# EAGLE design platform_smd2 (EAGLE 6.5.0)
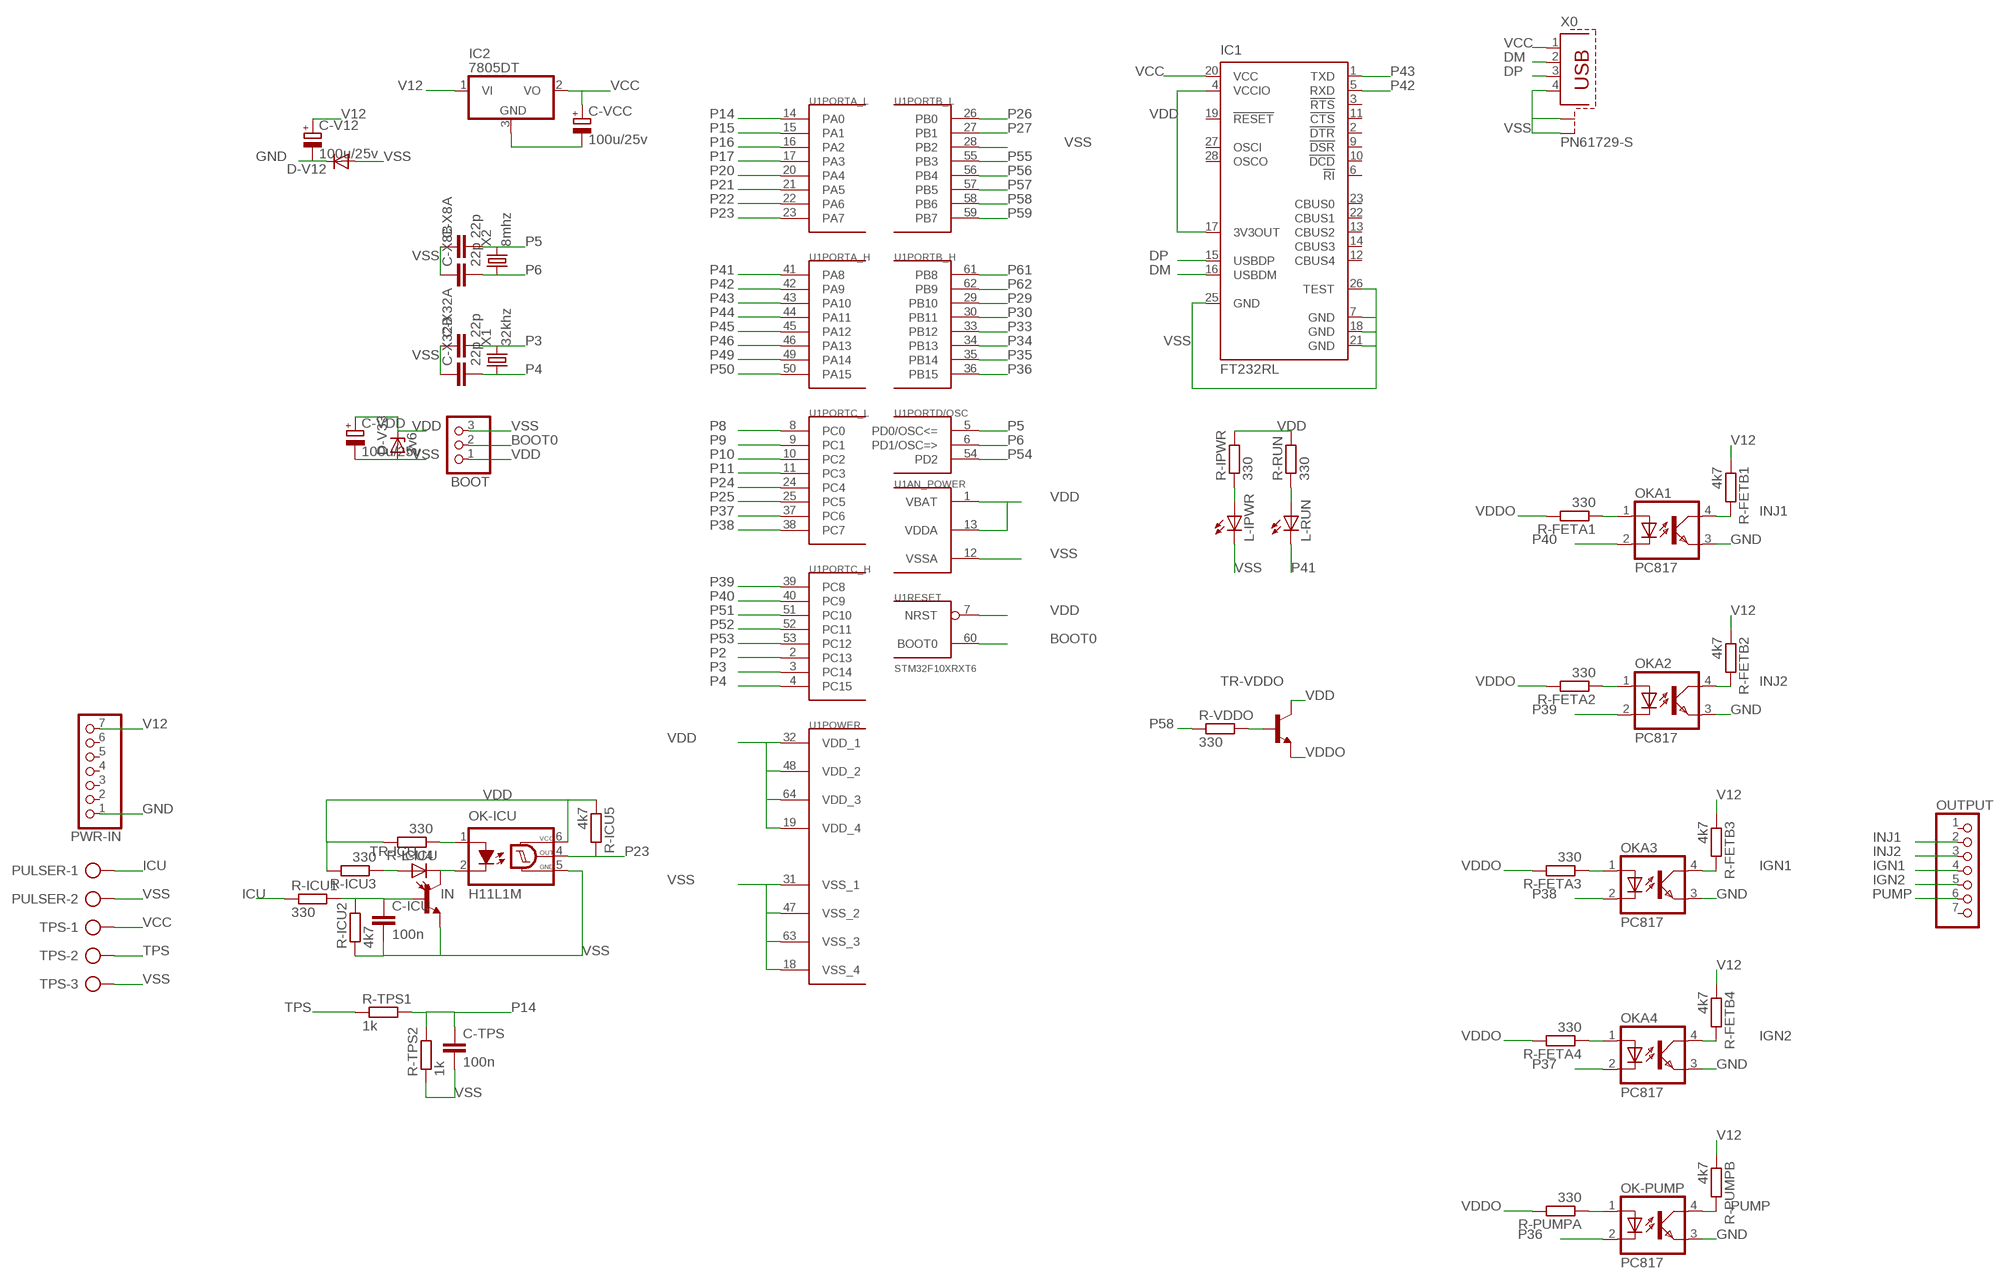
[diagram p0: schematic, sheet 1]

## Parts
BOOT  PINHD-1X3  [1X03]
C-ICU  100n  C-EUC1206  [C1206]
C-TPS  100n  C-EUC1206  [C1206]
C-V12  100u/25v  CPOL-EUD  [PANASONIC_D]
C-VCC  100u/25v  CPOL-EUD  [PANASONIC_D]
C-VDD  100u/25v  CPOL-EUD  [PANASONIC_D]
C-X8A  22p  C-EUC1206  [C1206]
C-X8B  22p  C-EUC1206  [C1206]
C-X32A  22p  C-EUC1206  [C1206]
C-X32B  22p  C-EUC1206  [C1206]
D-V12  DIODE-SMB  [SMB]
D-V33  3v6  ZENER-DIODESMB  [SMB]
IC1  FT232RL  [SSOP28]
IC2  7805DT  [TO252]
L-ICU  LEDSML0805  [SML0805]
L-IPWR  LEDSMT1206  [1206]
L-RUN  LEDSMT1206  [1206]
OK-ICU  H11L1M  [DIL06]
OK-PUMP  PC817  [DIL04]
OKA1  PC817  [DIL04]
OKA2  PC817  [DIL04]
OKA3  PC817  [DIL04]
OKA4  PC817  [DIL04]
OUTPUT  PINHD-1X7  [1X07]
PULSER  AK300/2  [AK300/2]
PWR-IN  PINHD-1X7  [1X07]
R-FETA1  330  R-EU_R1206  [R1206]
R-FETA2  330  R-EU_R1206  [R1206]
R-FETA3  330  R-EU_R1206  [R1206]
R-FETA4  330  R-EU_R1206  [R1206]
R-FETB1  4k7  R-EU_R1206  [R1206]
R-FETB2  4k7  R-EU_R1206  [R1206]
R-FETB3  4k7  R-EU_R1206  [R1206]
R-FETB4  4k7  R-EU_R1206  [R1206]
R-ICU1  330  R-EU_R1206  [R1206]
R-ICU2  4k7  R-EU_R1206  [R1206]
R-ICU3  330  R-EU_R1206  [R1206]
R-ICU4  330  R-EU_R1206  [R1206]
R-ICU5  4k7  R-EU_R1206  [R1206]
R-IPWR  330  R-EU_R1206  [R1206]
R-PUMPA  330  R-EU_R1206  [R1206]
R-PUMPB  4k7  R-EU_R1206  [R1206]
R-RUN  330  R-EU_R1206  [R1206]
R-TPS1  1k  R-EU_R1206  [R1206]
R-TPS2  1k  R-EU_R1206  [R1206]
R-VDDO  330  R-EU_R0805  [R0805]
TPS  AK300/3  [AK300/3]
TR-ICU  MMBT3904LT1-NPN-SOT23-BEC  [SOT23-BEC]
TR-VDDO  MMBT3904LT1-NPN-SOT23-BEC  [SOT23-BEC]
U1  STM32F10XRXT6  [TQFP64]
X0  PN61729-S  [PN61729-S]
X1  32khz  CRYSTALTC26V  [TC26V]
X2  8mhz  CRYSTALHC49U-V  [HC49U-V]

## Nets
BOOT0: BOOT.2 U1.60(RESET:BOOT0)
DM: IC1.16(USBDM) X0.2
DP: IC1.15(USBDP) X0.3
GND: C-V12.- D-V12.C OK-PUMP.3(EMIT) OKA1.3(EMIT) OKA2.3(EMIT) OKA3.3(EMIT) OKA4.3(EMIT) PWR-IN.1
ICU: PULSER.1 R-ICU1.1
IGN1: OKA3.4(COL) OUTPUT.4 R-FETB3.2
IGN2: OKA4.4(COL) OUTPUT.5 R-FETB4.2
IN: L-ICU.C OK-ICU.2(C) TR-ICU.C
INJ1: OKA1.4(COL) OUTPUT.2 R-FETB1.2
INJ2: OKA2.4(COL) OUTPUT.3 R-FETB2.2
N$3: C-ICU.1 R-ICU1.2 R-ICU2.2 TR-ICU.B
N$5: OK-ICU.1(A) R-ICU4.1
N$6: L-ICU.A R-ICU3.1
N$7: L-IPWR.A R-IPWR.1
N$8: L-RUN.A R-RUN.1
N$9: OK-PUMP.1(A) R-PUMPA.1
N$12: OKA2.1(A) R-FETA2.1
N$13: OKA1.1(A) R-FETA1.1
N$15: OKA3.1(A) R-FETA3.1
N$17: OKA4.1(A) R-FETA4.1
N$19: R-VDDO.2 TR-VDDO.B
P2: U1.2(PORTC_H:PC13)
P3: C-X32A.2 U1.3(PORTC_H:PC14) X1.2
P4: C-X32B.2 U1.4(PORTC_H:PC15) X1.1
P5: C-X8A.2 U1.5(PORTD/OSC:PD0/OSC<=) X2.2
P6: C-X8B.2 U1.6(PORTD/OSC:PD1/OSC=>) X2.1
P8: U1.8(PORTC_L:PC0)
P9: U1.9(PORTC_L:PC1)
P10: U1.10(PORTC_L:PC2)
P11: U1.11(PORTC_L:PC3)
P14: C-TPS.1 R-TPS1.2 R-TPS2.2 U1.14(PORTA_L:PA0)
P15: U1.15(PORTA_L:PA1)
P16: U1.16(PORTA_L:PA2)
P17: U1.17(PORTA_L:PA3)
P20: U1.20(PORTA_L:PA4)
P21: U1.21(PORTA_L:PA5)
P22: U1.22(PORTA_L:PA6)
P23: OK-ICU.4(OUT) R-ICU5.2 U1.23(PORTA_L:PA7)
P24: U1.24(PORTC_L:PC4)
P25: U1.25(PORTC_L:PC5)
P26: U1.26(PORTB_L:PB0)
P27: U1.27(PORTB_L:PB1)
P29: U1.29(PORTB_H:PB10)
P30: U1.30(PORTB_H:PB11)
P33: U1.33(PORTB_H:PB12)
P34: U1.34(PORTB_H:PB13)
P35: U1.35(PORTB_H:PB14)
P36: OK-PUMP.2(C) U1.36(PORTB_H:PB15)
P37: OKA4.2(C) U1.37(PORTC_L:PC6)
P38: OKA3.2(C) U1.38(PORTC_L:PC7)
P39: OKA2.2(C) U1.39(PORTC_H:PC8)
P40: OKA1.2(C) U1.40(PORTC_H:PC9)
P41: L-RUN.C U1.41(PORTA_H:PA8)
P42: IC1.5(RXD) U1.42(PORTA_H:PA9)
P43: IC1.1(TXD) U1.43(PORTA_H:PA10)
P44: U1.44(PORTA_H:PA11)
P45: U1.45(PORTA_H:PA12)
P46: U1.46(PORTA_H:PA13)
P49: U1.49(PORTA_H:PA14)
P50: U1.50(PORTA_H:PA15)
P51: U1.51(PORTC_H:PC10)
P52: U1.52(PORTC_H:PC11)
P53: U1.53(PORTC_H:PC12)
P54: U1.54(PORTD/OSC:PD2)
P55: U1.55(PORTB_L:PB3)
P56: U1.56(PORTB_L:PB4)
P57: U1.57(PORTB_L:PB5)
P58: R-VDDO.1 U1.58(PORTB_L:PB6)
P59: U1.59(PORTB_L:PB7)
P61: U1.61(PORTB_H:PB8)
P62: U1.62(PORTB_H:PB9)
PUMP: OK-PUMP.4(COL) OUTPUT.6 R-PUMPB.2
TPS: R-TPS1.1 TPS.2
V12: C-V12.+ IC2.1(VI) PWR-IN.7 R-FETB1.1 R-FETB2.1 R-FETB3.1 R-FETB4.1 R-PUMPB.1
VCC: C-VCC.+ IC1.20(VCC) IC2.2(VO) TPS.1 X0.1
VDD: BOOT.1 C-VDD.+ D-V33.C IC1.4(VCCIO) IC1.17(3V3OUT) OK-ICU.6(VCC) R-ICU3.2 R-ICU4.2 R-ICU5.1 R-IPWR.2 R-RUN.2 TR-VDDO.C U1.1(AN_POWER:VBAT) U1.7(RESET:NRST) U1.13(AN_POWER:VDDA) U1.19(POWER:VDD_4) U1.32(POWER:VDD_1) U1.48(POWER:VDD_2) U1.64(POWER:VDD_3)
VDDO: R-FETA1.2 R-FETA2.2 R-FETA3.2 R-FETA4.2 R-PUMPA.2 TR-VDDO.E
VSS: BOOT.3 C-ICU.2 C-TPS.2 C-VCC.- C-VDD.- C-X8A.1 C-X8B.1 C-X32A.1 C-X32B.1 D-V12.A D-V33.A IC1.7(GND) IC1.18(GND) IC1.21(GND) IC1.25(GND) IC1.26(TEST) IC2.3(GND) L-IPWR.C OK-ICU.5(GND) PULSER.2 R-ICU2.1 R-TPS2.1 TPS.3 TR-ICU.E U1.12(AN_POWER:VSSA) U1.18(POWER:VSS_4) U1.28(PORTB_L:PB2) U1.31(POWER:VSS_1) U1.47(POWER:VSS_2) U1.63(POWER:VSS_3) X0.4 X0.S1 X0.S2
Unconnected: IC1.2(!DTR) IC1.3(!RTS) IC1.6(!RI) IC1.9(!DSR) IC1.10(!DCD) IC1.11(!CTS) IC1.12(CBUS4) IC1.13(CBUS2) IC1.14(CBUS3) IC1.19(!RESET) IC1.22(CBUS1) IC1.23(CBUS0) IC1.27(OSCI) IC1.28(OSCO) OUTPUT.1 OUTPUT.7 PWR-IN.2 PWR-IN.3 PWR-IN.4 PWR-IN.5 PWR-IN.6

## Library data of the parts
BOOT = pinhead:PINHD-1X3: PIN HEADER
C-ICU C-TPS C-X8A C-X8B C-X32A C-X32B = resistor:C-EU: CAPACITOR, European symbol
C-V12 C-VCC C-VDD = resistor:CPOL-EU: POLARIZED CAPACITOR, European symbol
D-V12 = diode:DIODE-: DIODE
D-V33 = diode:ZENER-DIODE: Z-Diode
IC1 = ftdichip:FT232R: Source: http://www.ftdichip.com/Documents/DataSheets/DS_FT232R_v104.pdf; MPN: FT232RL; OC_FARNELL: 1146032; OC_NEWARK: 91K9918
IC2 = linear:78*: Positive VOLTAGE REGULATOR Source: http://cache.national.com/ds/LM/LM78L05.pdf http://www.fairchildsemi.com/ds/LM/LM7805.pdf
L-ICU L-IPWR L-RUN = led:LED: LED OSRAM: - CHIPLED LG R971, LG N971, LY N971, LG Q971, LY Q971, LO R971, LY R971 LH N974, LH R974 LS Q976, LO Q976, LY Q976 LO Q996 - Hyper CHIPLED LW Q18S LB Q993, LB Q99A, LB R99A - SideLED LS A670, LO A670, LY A670, LG A670, LP A670 LB A673, LV A673, LT A673, LW A673 LH A674 LY A675 LS A676, LA A676, LO A676, LY A676, LW A676 LS A679, LY A679, LG A679 - Hyper Micro SIDELED® LS Y876, LA Y876, LO Y876, LY Y876 LT Y87S - SmartLED LW L88C, LW L88S LB L89C, LB L89S, LG L890 LS L89K, LO L89K, LY L89K LS L896, LA L896, LO L896, LY L896 - TOPLED LS T670, LO T670, LY T670, LG T670, LP T670 LSG T670, LSP T670, LSY T670, LOP T670, LYG T670 LG T671, LOG T671, LSG T671 LB T673, LV T673, LT T673, LW T673 LH T674 LS T676, LA T676, LO T676, LY T676, LB T676, LH T676, LSB T676, LW T676 LB T67C, LV T67C, LT T67C, LS T67K, LO T67K, LY T67K, LW E67C LS E67B, LA E67B, LO E67B, LY E67B, LB E67C, LV E67C, LT E67C LW T67C LS T679, LY T679, LG T679 LS T770, LO T770, LY T770, LG T770, LP T770 LB T773, LV T773, LT T773, LW T773 LH T774 LS E675, LA E675, LY E675, LS T675 LS T776, LA T776, LO T776, LY T776, LB T776 LHGB T686 LT T68C, LB T68C - Hyper Mini TOPLED® LB M676 - Mini TOPLED Santana® LG M470 LS M47K, LO M47K, LY M47K Source: http://www.osram.convergy.de LUXEON: - LUMILED® LXK2-PW12-R00, LXK2-PW12-S00, LXK2-PW14-U00, LXK2-PW14-V00 LXK2-PM12-R00, LXK2-PM12-S00, LXK2-PM14-U00 LXK2-PE12-Q00, LXK2-PE12-R00, LXK2-PE12-S00, LXK2-PE14-T00, LXK2-PE14-U00 LXK2-PB12-K00, LXK2-PB12-L00, LXK2-PB12-M00, LXK2-PB14-N00, LXK2-PB14-P00, LXK2-PB14-Q00 LXK2-PR12-L00, LXK2-PR12-M00, LXK2-PR14-Q00, LXK2-PR14-R00 LXK2-PD12-Q00, LXK2-PD12-R00, LXK2-PD12-S00 LXK2-PH12-R00, LXK2-PH12-S00 LXK2-PL12-P00, LXK2-PL12-Q00, LXK2-PL12-R00 Source: www.luxeon.com KINGBRIGHT: KA-3528ASYC Source: www.kingbright.com
OK-ICU = optocoupler:H11L*M: 6-Pin DIP Optocoupler Source: http://www.fairchildsemi.com/ds/H1/H11L2-M.pdf; MF: FAIRCHILD SEMICONDUCTOR; MPN: H11L1-M; OC_FARNELL: 1021127; OC_NEWARK: 72K8643
OK-PUMP OKA1-OKA4 = optocoupler:PC817: SHARP OPTO COUPLER; MPN: PC817X4J000F; OC_FARNELL: 9707727; OC_NEWARK: 97K7059
OUTPUT PWR-IN = pinhead:PINHD-1X7: PIN HEADER
PULSER = con-ptr500:AK300/2: CONNECTOR; OC_FARNELL: unknown; OC_NEWARK: unknown
R-FETA1-R-FETA4 R-FETB1-R-FETB4 R-ICU1-R-ICU5 R-IPWR R-PUMPA R-PUMPB R-RUN R-TPS1 R-TPS2 R-VDDO = resistor:R-EU_: RESISTOR, European symbol
TPS = con-ptr500:AK300/3: CONNECTOR; OC_FARNELL: unknown; OC_NEWARK: unknown
TR-ICU TR-VDDO = transistor:*-NPN-: NPN Transistror BF959 corrected 2008.03.06
U1 = stm32:STM32F10XRXT6: STM32F101/103 64pin LQFP
X0 = con-berg:PN61729-S: BERG USB connector; OC_FARNELL: unknown; OC_NEWARK: unknown
X1 = crystal:CRYSTAL: CRYSTAL; OC_FARNELL: unknown; OC_NEWARK: unknown
X2 = crystal:CRYSTAL: CRYSTAL; OC_FARNELL: 1666969; OC_NEWARK: unknown

## Board
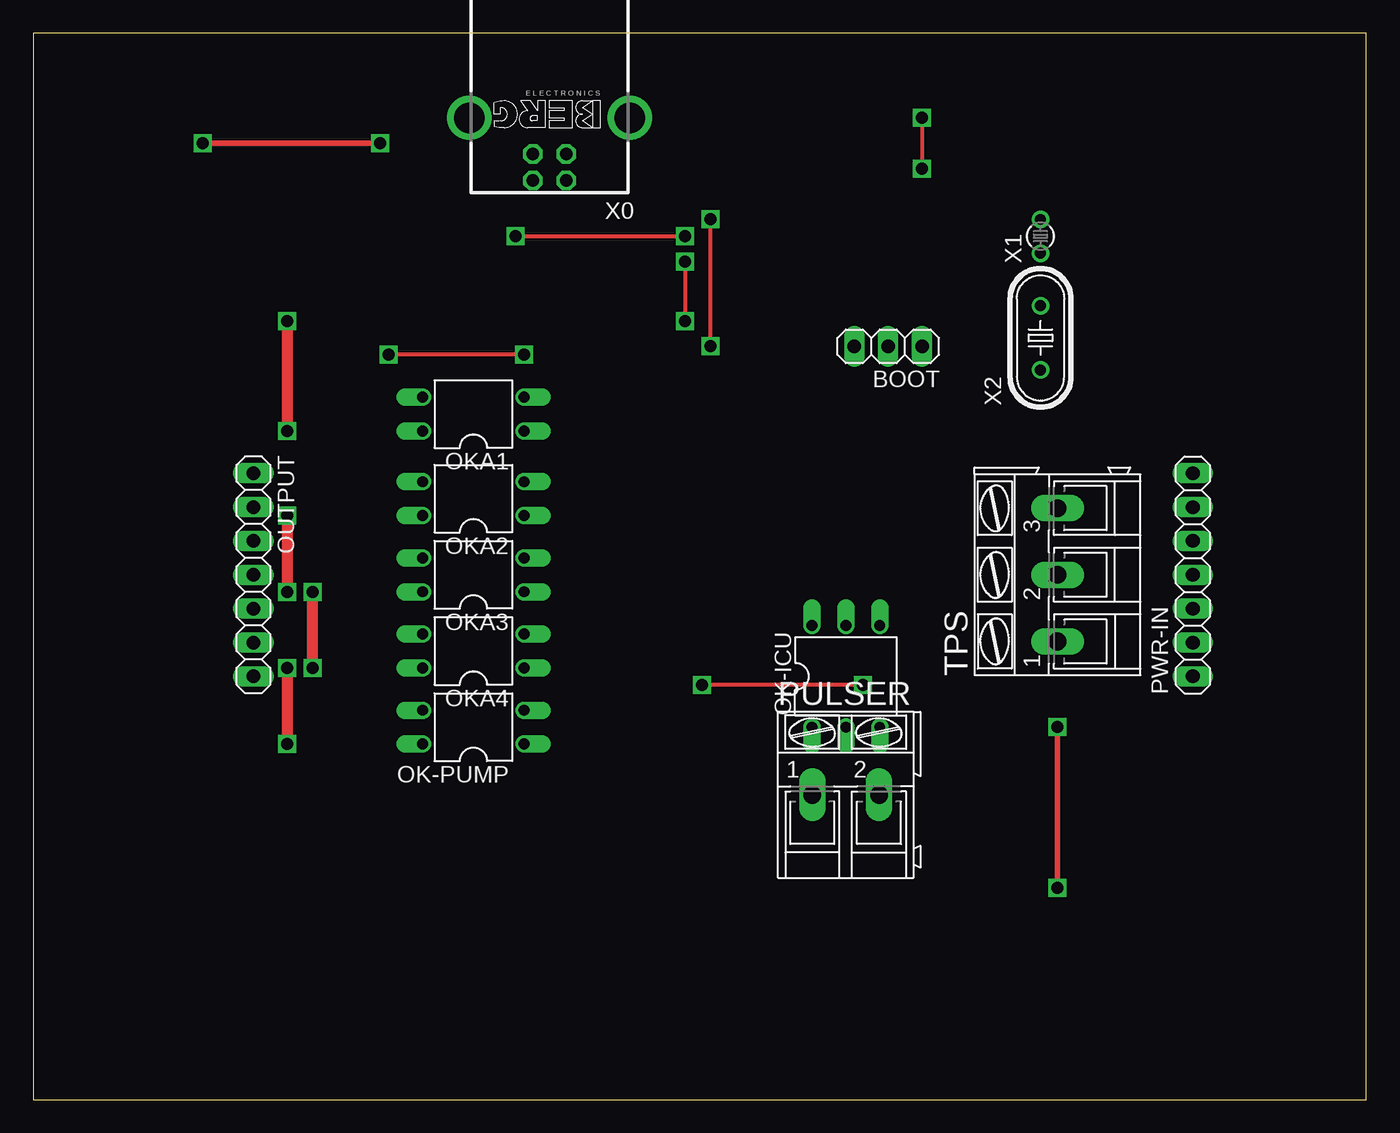
[diagram p1: board, top side]
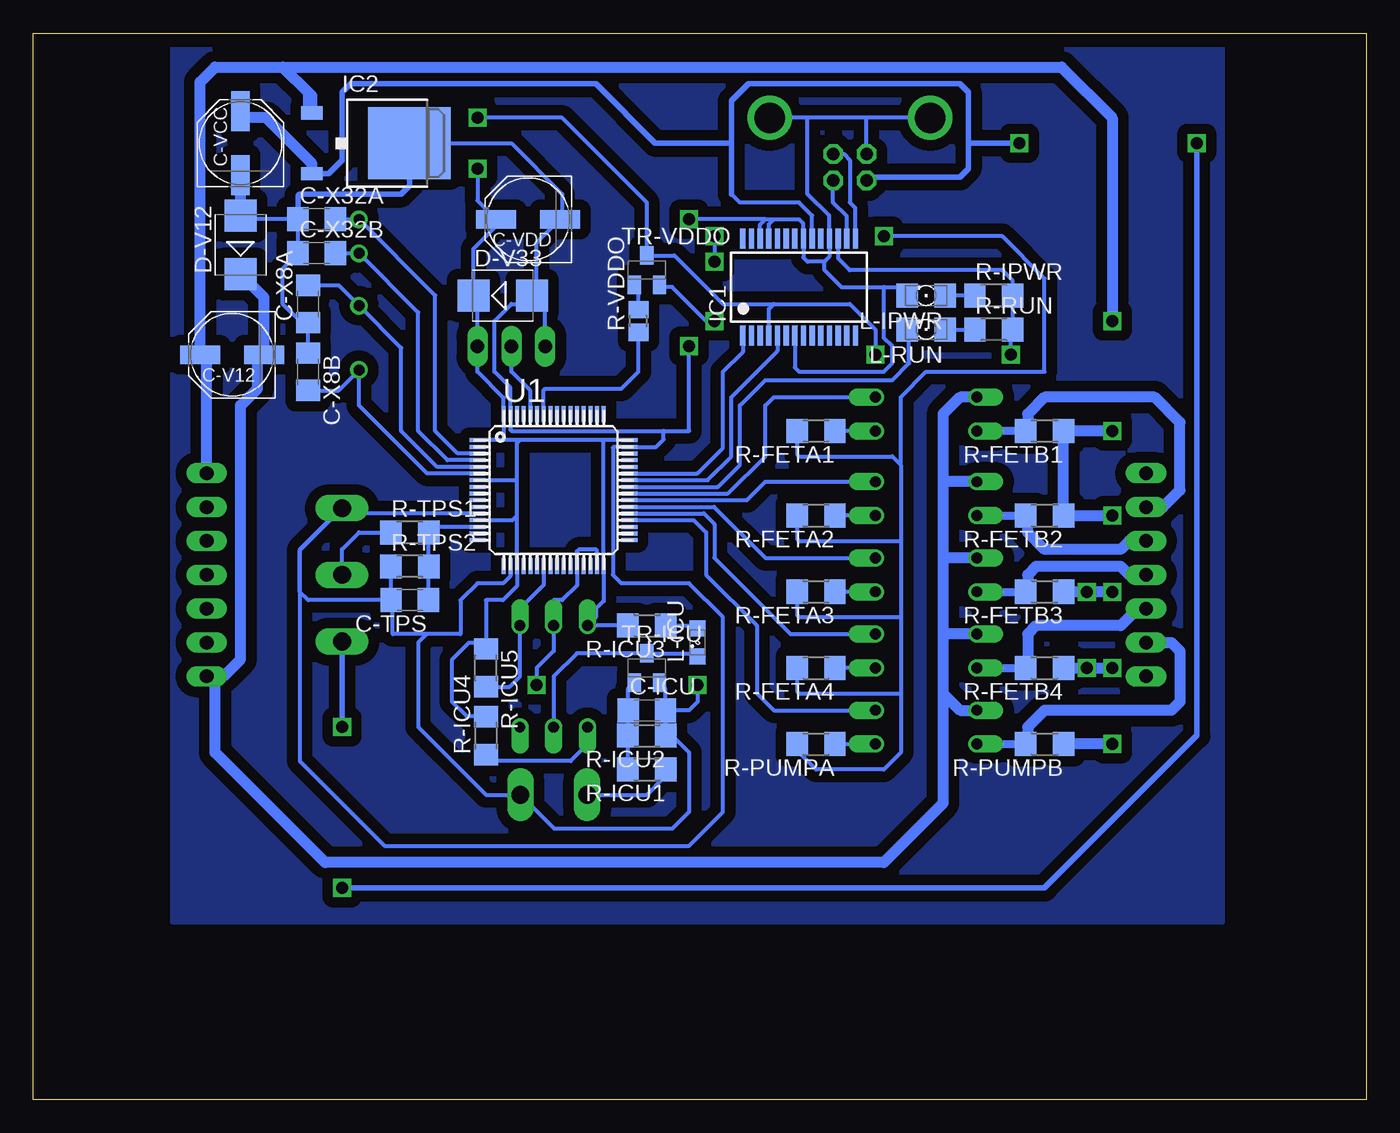
[diagram p2: board, bottom side, seen from below]

Size 100 x 80 mm. Coordinates in mm from the lower left corner, seen from the top.
Outline: 0,0 100,0 100,80 0,80 0,0
Copper layers (1*16): Top 0.035mm / dielectric 1.5mm / Bottom 0.035mm
Design rules "default": minimum track width 10mil, minimum drill 24mil, track to track 8mil, track to pad 8mil, pad to pad 8mil, via to via 8mil, smd to smd 8mil, copper to edge 40mil, drill to drill 8mil, minimum pad ring 10mil, minimum via ring 8mil, stop-mask expansion 4mil, vias tented up to drill 0mil, thermal gap 10mil

### Footprints (pad centres in the part's own frame; a part is rotated, then mirrored left to right if it is on the bottom)
1X03 = drill 1.016 long: 1 -2.54,0; 2 0,0; 3 2.54,0
C1206 = smd 1.6 x 1.8: 1 -1.4,0; 2 1.4,0
PANASONIC_D = smd 3 x 1.4: + 2.4,0; - -2.4,0
SMB = smd 2.4 x 2.4: A 2.2,0; C -2.2,0
SSOP28 = smd 0.4 x 1.5: 1 -4.225,-3.625; 2 -3.575,-3.625; 3 -2.925,-3.625; 4 -2.275,-3.625; 5 -1.625,-3.625; 6 -0.975,-3.625; 7 -0.325,-3.625; 8 0.325,-3.625; 9 0.975,-3.625; 10 1.625,-3.625; 11 2.275,-3.625; 12 2.925,-3.625; 13 3.575,-3.625; 14 4.225,-3.625; 15 4.225,3.625; 16 3.575,3.625; 17 2.925,3.625; 18 2.275,3.625; 19 1.625,3.625; 20 0.975,3.625; 21 0.325,3.625; 22 -0.325,3.625; 23 -0.975,3.625; 24 -1.625,3.625; 25 -2.275,3.625; 26 -2.925,3.625; 27 -3.575,3.625; 28 -4.225,3.625
TO252 = smd 1 x 1.6: 1 -2.28,-4.8; 2 2.28,-4.8 | smd 5.4 x 6.2: 3 0,2.5
SML0805 = smd 1.2 x 1.2: A 1.05,0; C -1.05,0
1206 = smd 1.6 x 1.803: A -1.422,0; C 1.422,0
DIL06 = drill 0.813 offset: 1 -2.54,-3.81; 2 0,-3.81; 3 2.54,-3.81; 4 2.54,3.81; 5 0,3.81; 6 -2.54,3.81
DIL04 = drill 0.813 offset: 1 -1.27,-3.81; 2 1.27,-3.81; 3 1.27,3.81; 4 -1.27,3.81
1X07 = drill 1.016 long: 1 -7.62,0; 2 -5.08,0; 3 -2.54,0; 4 0,0; 5 2.54,0; 6 5.08,0; 7 7.62,0
AK300/2 = drill 1.321 long: 1 -2.515,0; 2 2.489,0
R1206 = smd 1.6 x 1.803: 1 -1.422,0; 2 1.422,0
R0805 = smd 1.3 x 1.5: 1 -0.85,0; 2 0.85,0
AK300/3 = drill 1.321 long: 1 -5.004,0; 2 0,0; 3 5.004,0
SOT23-BEC = smd 1 x 1.4: B -0.95,-1.1; C 0,1.1; E 0.95,-1.1
TQFP64 = smd 1.2 x 0.3: 1 -5.7,3.75; 2 -5.7,3.25; 3 -5.7,2.75; 4 -5.7,2.25; 5 -5.7,1.75; 6 -5.7,1.25; 7 -5.7,0.75; 8 -5.7,0.25; 9 -5.7,-0.25; 10 -5.7,-0.75; 11 -5.7,-1.25; 12 -5.7,-1.75; 13 -5.7,-2.25; 14 -5.7,-2.75; 15 -5.7,-3.25; 16 -5.7,-3.75; 33 5.7,-3.75; 34 5.7,-3.25; 35 5.7,-2.75; 36 5.7,-2.25; 37 5.7,-1.75; 38 5.7,-1.25; 39 5.7,-0.75; 40 5.7,-0.25; 41 5.7,0.25; 42 5.7,0.75; 43 5.7,1.25; 44 5.7,1.75; 45 5.7,2.25; 46 5.7,2.75; 47 5.7,3.25; 48 5.7,3.75 | smd 0.3 x 1.2: 17 -3.75,-5.7; 18 -3.25,-5.7; 19 -2.75,-5.7; 20 -2.25,-5.7; 21 -1.75,-5.7; 22 -1.25,-5.7; 23 -0.75,-5.7; 24 -0.25,-5.7; 25 0.25,-5.7; 26 0.75,-5.7; 27 1.25,-5.7; 28 1.75,-5.7; 29 2.25,-5.7; 30 2.75,-5.7; 31 3.25,-5.7; 32 3.75,-5.7; 49 3.75,5.7; 50 3.25,5.7; 51 2.75,5.7; 52 2.25,5.7; 53 1.75,5.7; 54 1.25,5.7; 55 0.75,5.7; 56 0.25,5.7; 57 -0.25,5.7; 58 -0.75,5.7; 59 -1.25,5.7; 60 -1.75,5.7; 61 -2.25,5.7; 62 -2.75,5.7; 63 -3.25,5.7; 64 -3.75,5.7
PN61729-S = drill 0.95 octagon: 1 1.25,4.71; 2 -1.25,4.71; 3 -1.25,2.71; 4 1.25,2.71 | drill 2.3 pad 2.9: S1 -6.02,0; S2 6.02,0
TC26V = drill 0.813: 1 -1.27,0; 2 1.27,0
HC49U-V = drill 0.813: 1 -2.413,0; 2 2.413,0

### Placement (x,y rotation side)
BOOT  64.14,56.52 180 top
C-ICU  53.98,29.21 0 bottom
C-TPS  71.75,37.47 180 bottom
C-V12  85.09,55.88 180 bottom
C-VCC  84.45,71.75 90 bottom
C-VDD  62.87,66.04 180 bottom
C-X8A  79.38,59.69 90 bottom
C-X8B  79.38,54.61 270 bottom
C-X32A  78.74,66.04 0 bottom
C-X32B  78.74,63.5 0 bottom
D-V12  84.45,64.14 90 bottom
D-V33  64.77,60.33 0 bottom
IC1  42.55,60.96 0 bottom
IC2  74.3,71.75 270 bottom
L-ICU  50.16,34.29 90 bottom
L-IPWR  33.02,60.33 180 bottom
L-RUN  33.02,57.78 180 bottom
OK-ICU  60.96,31.75 0 top
OK-PUMP  33.02,27.94 90 top
OKA1  33.02,51.44 90 top
OKA2  33.02,45.09 90 top
OKA3  33.02,39.37 90 top
OKA4  33.02,33.66 90 top
OUTPUT  16.51,39.37 270 top
PULSER  60.96,22.86 0 top
PWR-IN  87,39.37 90 top
R-FETA1  41.27,50.16 180 bottom
R-FETA2  41.27,43.81 180 bottom
R-FETA3  41.27,38.1 180 bottom
R-FETA4  41.27,32.38 180 bottom
R-FETB1  24.13,50.16 180 bottom
R-FETB2  24.13,43.81 180 bottom
R-FETB3  24.13,38.1 180 bottom
R-FETB4  24.13,32.38 180 bottom
R-ICU1  53.98,24.77 180 bottom
R-ICU2  53.98,27.3 180 bottom
R-ICU3  53.98,35.56 180 bottom
R-ICU4  66.04,27.3 90 bottom
R-ICU5  66.04,32.38 270 bottom
R-IPWR  27.94,60.33 0 bottom
R-PUMPA  41.27,26.67 180 bottom
R-PUMPB  24.13,26.67 180 bottom
R-RUN  27.94,57.78 0 bottom
R-TPS1  71.75,42.55 0 bottom
R-TPS2  71.75,40.01 0 bottom
R-VDDO  54.61,58.42 90 bottom
TPS  76.83,39.37 90 top
TR-ICU  53.98,32.38 0 bottom
TR-VDDO  53.98,62.23 0 bottom
U1  60.96,45.72 0 bottom
X0  38.73,73.66 180 top
X1  75.56,64.77 90 top
X2  75.56,57.15 90 top

### Tracks (layer width: path | path; a pad name or v marks a point on that pad's centre or on a via)
BOOT0
  Bottom 0.305: U1.60 62.71,53.19 64.14,54.61 BOOT.2
DM
  Bottom 0.305: IC1.16 38.97,66.28 40.01,67.31 40.01,68.93 X0.2
DP
  Bottom 0.305: IC1.15 38.32,66.89 38.73,67.31 38.73,70.48 39.2,70.95 X0.3
GND
  Bottom 0.813: OKA1.3 30.48,52.7 31.75,51.44 31.75,46.35 | 31.75,46.35 31.75,40.64 | 31.75,40.64 31.75,34.92 | 31.75,34.92 31.75,30.48 | 31.75,30.48 30.48,29.21 OK-PUMP.3 | OKA4.3 31.75,34.92 | OKA3.3 31.75,40.64 | OKA2.3 31.75,46.35 | PWR-IN.1 86.36,31.75 | 86.36,31.75 85.72,31.75 84.45,33.02 84.45,52.07 83.19,53.34 83.19,55.38 C-V12.- 82.69,60.17 D-V12.C | 31.75,30.48 31.75,22.23 36.2,17.78 78.11,17.78 86.36,26.04 86.36,31.75
ICU
  Bottom 0.305: PULSER.1 53.98,22.86 52.7,24.13 52.7,24.61 R-ICU1.1
IGN1
  Bottom 0.61: OKA3.4 R-FETB3.2
  Bottom 0.813: R-FETB3.2 25.4,38.25 25.4,39.37 24.77,40.01 18.41,40.01 17.78,39.37 OUTPUT.4
IGN2
  Bottom 0.61: OKA4.4 R-FETB4.2
  Bottom 0.813: R-FETB4.2 25.4,32.54 25.4,34.92 24.77,35.56 18.41,35.56 17.14,36.83 OUTPUT.5
IN
  Bottom 0.305: L-ICU.C 50.41,33.48 TR-ICU.C 59.23,33.48 60.96,31.75 OK-ICU.2
INJ1
  Bottom 0.61: R-FETB1.2 OKA1.4
  Bottom 0.813: OUTPUT.2 15.24,44.45 13.97,45.72 13.97,50.8 15.88,52.7 24.13,52.7 25.4,51.44 25.4,50.32 R-FETB1.2
INJ2
  Bottom 0.61: OKA2.4 R-FETB2.2
  Bottom 0.813: OUTPUT.3 17.78,41.91 18.41,41.27 24.13,41.27 25.4,42.55 25.4,43.66 R-FETB2.2
N$1
  pour Bottom (isolate 0.813): 10.79,80.01 89.53,80.01 89.53,13.34 10.79,13.34
N$3
  Bottom 0.305: R-ICU1.2 R-ICU2.2 | R-ICU2.2 55.4,27.46 55.88,27.94 | R-ICU2.2 55.38,27.33 C-ICU.1 55.38,30.84 TR-ICU.B
N$5
  Bottom 0.305: OK-ICU.1 58.42,26.67 59.69,25.4 65.56,25.4 R-ICU4.1
N$6
  Bottom 0.305: R-ICU3.1 50.38,35.56 L-ICU.A
N$7
  Bottom 0.305: R-IPWR.1 L-IPWR.A
N$8
  Bottom 0.305: L-RUN.A R-RUN.1
N$9
  Bottom 0.305: R-PUMPA.1 OK-PUMP.1
N$12
  Bottom 0.305: OKA2.1 R-FETA2.1
N$13
  Bottom 0.305: OKA1.1 R-FETA1.1
N$15
  Bottom 0.305: OKA3.1 R-FETA3.1
N$17
  Bottom 0.305: OKA4.1 R-FETA4.1
N$19
  Bottom 0.305: R-VDDO.2 54.61,60.81 TR-VDDO.B
P3
  Bottom 0.305: U1.3 68.16,48.47 69.85,50.16 69.85,60.33 X1.2 C-X32A.2
P4
  Bottom 0.305: U1.4 68.92,47.97 71.12,50.16 71.12,59.05 X1.1 C-X32B.2
P5
  Bottom 0.305: U1.5 69.69,47.47 72.39,50.16 72.39,56.39 X2.2 77.09,61.09 C-X8A.2
P6
  Bottom 0.305: U1.6 70.47,46.97 75.56,52.07 X2.1 77.09,53.21 C-X8B.2
P14
  Bottom 0.305: U1.14 69.91,42.97 R-TPS1.2 R-TPS2.2 70.36,39.98 C-TPS.1
P23
  Bottom 0.305: U1.23 61.71,38.62 63.5,36.83 OK-ICU.4 63.5,31.75 64.29,30.96 R-ICU5.2
P36
  Bottom 0.305: U1.36 50.45,43.47 49.53,42.55 49.53,39.37 45.72,35.56 45.72,30.48 44.45,29.21 OK-PUMP.2
P37
  Bottom 0.305: U1.37 49.69,43.97 48.9,43.18 48.9,40.64 43.18,34.92 OKA4.2
P38
  Bottom 0.305: U1.38 48.91,44.47 45.09,40.64 OKA3.2
P39
  Bottom 0.305: U1.39 46.47,44.97 45.09,46.35 OKA2.2
P40
  Bottom 0.305: U1.40 47.88,45.47 45.09,48.26 45.09,52.07 44.45,52.7 OKA1.2
P41
  Bottom 0.305: U1.41 48.65,45.97 46.99,47.62 46.99,52.07 45.09,53.98 35.56,53.98 34.29,55.24 34.29,57.63 L-RUN.C
P42
  Bottom 0.305: U1.42 49.41,46.47 47.62,48.26 47.62,52.7 44.17,56.16 IC1.5
P43
  Bottom 0.305: U1.43 50.19,46.97 48.26,48.9 48.26,54.61 46.77,56.1 IC1.1
P58
  Bottom 0.305: U1.58 61.71,53.23 61.59,53.34 55.88,53.34 54.61,54.61 R-VDDO.1
PUMP
  Bottom 0.61: OK-PUMP.4 R-PUMPB.2
  Bottom 0.813: OUTPUT.6 14.61,34.29 13.97,33.66 13.97,29.84 14.61,29.21 24.13,29.21 25.4,27.94 25.4,26.82 R-PUMPB.2
TPS
  Bottom 0.305: TPS.2 76.83,41.27 75.56,42.55 R-TPS1.1
V12  (via drill 0.9)
  Top 0.813: v19.05,32.38 v19.05,26.67 | v20.95,32.38 v20.95,38.1 | v19.05,43.81 v19.05,38.1 | v19.05,58.42 v19.05,50.16
  Bottom 0.813: PWR-IN.7 87,55.38 C-V12.+ 87.49,76.34 86.36,77.47 81.28,77.47 | 81.28,77.47 79.38,75.56 | 79.38,75.56 79.38,74.31 IC2.1 79.09,75.28 79.38,75.56 | v19.05,32.38 v20.95,32.38 R-FETB4.1 | v19.05,26.67 R-PUMPB.1 | R-FETB3.1 v20.95,38.1 v19.05,38.1 | v19.05,43.81 R-FETB2.1 R-FETB1.1 v19.05,50.16 | 81.28,77.47 22.86,77.47 19.05,73.66 v19.05,58.42
VCC  (via drill 0.9)
  Top 0.406: v76.83,27.94 v76.83,15.88 | v12.7,71.75 v26.04,71.75
  Bottom 0.305: IC1.20 41.57,66.33 42.55,67.31 46.99,67.31 47.62,67.94
  Bottom 0.406: 47.62,67.94 47.62,71.75 | 47.62,71.75 47.62,74.93 46.35,76.2 30.48,76.2 29.84,75.56 29.84,71.75 | 29.84,71.75 29.84,69.85 30.48,69.22 37.22,69.22 X0.1 | IC2.2 77.84,69.47 76.83,70.48 76.83,75.56 76.2,76.2 57.78,76.2 53.34,71.75 47.62,71.75 | TPS.1 v76.83,27.94 | v76.83,15.88 24.13,15.88 12.7,27.3 v12.7,71.75 | v26.04,71.75 29.84,71.75
  Bottom 0.813: IC2.2 79.09,70.2 82.55,73.66 83.96,73.66 C-VCC.+
VDD  (via drill 0.9)
  Top 0.305: v36.83,55.88 v26.67,55.88 | v66.67,73.66 v66.67,69.85
  Bottom 0.305: U1.48 57.15,49.47 | 57.15,49.47 63.5,49.47 | 63.5,49.47 64.77,49.47 | 64.77,49.47 U1.1 | 64.77,49.47 64.71,49.53 U1.64 64.71,52.65 66.67,54.61 BOOT.1 66.67,59.69 67.31,60.33 D-V33.C 66.97,63.84 64.77,66.04 C-VDD.+ 66.67,67.45 v66.67,69.85 | 57.15,49.47 57.21,49.41 U1.32 57.21,37.41 57.78,36.83 57.78,36.2 OK-ICU.6 R-ICU3.2 | 63.71,43.81 U1.19 63.71,38.52 64.77,37.47 66.04,37.47 R-ICU5.1 66.52,34.29 67.31,34.29 68.58,33.02 68.58,29.84 67.46,28.73 R-ICU4.2 | 63.71,43.81 63.71,46.35 | 63.71,46.35 63.71,49.26 63.5,49.47 | U1.7 63.83,46.47 63.71,46.35 | U1.13 64.06,43.47 63.71,43.81 | IC1.17 39.62,63.12 38.73,62.23 27.3,62.23 26.52,61.44 R-IPWR.2 R-RUN.2 26.67,57.63 v26.67,55.88 | IC1.4 44.82,59.32 44.45,59.69 | 44.45,59.69 38.73,59.69 36.83,57.78 v36.83,55.88 | 44.45,59.69 48.26,59.69 51.9,63.33 TR-VDDO.C 53.98,67.31 60.33,73.66 v66.67,73.66
VDDO  (via drill 0.9)
  Top 0.305: v36.2,64.77 v48.9,64.77 | v48.9,62.87 v48.9,58.42
  Bottom 0.305: 34.92,47.62 34.92,41.91 | 34.92,41.91 34.92,36.2 | 34.92,36.2 34.92,30.48 | 34.92,30.48 34.92,26.04 36.2,24.77 41.27,24.77 42.55,26.04 42.55,26.52 R-PUMPA.2 | R-FETA2.2 42.7,42.06 42.55,41.91 34.92,41.91 | R-FETA3.2 42.7,36.35 42.55,36.2 34.92,36.2 | R-FETA4.2 42.7,30.63 42.55,30.48 34.92,30.48 | R-FETA1.2 42.7,48.41 42.55,48.26 35.56,48.26 34.92,47.62 | 34.92,47.62 34.92,52.7 33.02,54.61 24.13,54.61 24.13,61.59 27.3,64.77 v36.2,64.77 | v48.9,64.77 v48.9,62.87 | v48.9,58.42 49.53,58.42 52.07,60.96 52.85,60.96 TR-VDDO.E
VSS  (via drill 0.9)
  Top 0.305: v62.23,31.11 v50.16,31.11 | v50.8,56.52 v50.8,66.04
  Bottom 0.305: C-X8B.1 C-X8A.1 79.88,58.29 81.28,59.69 81.28,62.36 C-X32B.1 C-X32A.1 84.16,66.04 D-V12.A | C-TPS.2 73.16,39.98 R-TPS2.1 73.18,37.62 73.03,37.47 C-TPS.2 | C-TPS.2 79.38,37.47 80.01,38.1 80.01,41.2 TPS.3 76.43,43.97 U1.12 76.36,43.97 76.83,44.45 80.01,41.27 80.01,25.4 73.66,19.05 50.8,19.05 48.26,21.59 48.26,36.2 50.8,38.73 55.88,38.73 56.52,39.37 56.52,48.9 56.44,48.97 U1.47 53.27,48.97 52.7,49.53 52.7,50.16 | U1.31 57.71,41.2 57.78,41.27 59.05,41.27 59.21,41.12 U1.28 59.21,38.58 60.33,37.47 60.96,37.47 OK-ICU.5 60.96,33.66 62.23,32.38 v62.23,31.11 | 52.7,50.16 64.14,50.16 64.21,50.24 U1.63 64.21,53.41 65.41,54.61 65.41,58.42 64.14,59.69 62.23,59.69 62.08,59.84 | BOOT.3 61.59,59.35 62.08,59.84 | 62.08,59.84 D-V33.A 62.57,60.62 62.23,60.96 62.23,64.28 C-VDD.- 60.33,66.18 60.33,67.94 64.14,71.75 IC2.3 | C-ICU.2 52.58,30.84 TR-ICU.E | C-ICU.2 52.58,27.33 R-ICU2.1 52.07,27.3 50.8,26.04 50.8,21.59 52.07,20.32 60.91,20.32 PULSER.2 66.04,22.86 71.12,27.94 71.12,34.29 70.48,34.92 | v50.16,31.11 50.16,29.84 50.8,29.21 C-ICU.2 | U1.18 64.21,39.3 64.77,38.73 66.67,38.73 67.94,37.47 67.94,34.92 70.48,34.92 | 70.48,34.92 73.03,34.92 73.03,37.34 C-TPS.2 | IC1.26 45.47,65.66 45.09,66.04 | 45.09,66.04 44.45,66.04 | 44.45,66.04 42.55,66.04 42.22,65.72 IC1.21 42.22,63.17 41.91,62.87 40.64,62.87 | IC1.25 44.82,65.67 44.45,66.04 | X0.S2 37.47,73.66 | 37.47,73.66 41.91,73.66 | 41.91,73.66 X0.S1 | X0.4 37.48,73.64 37.47,73.66 | 40.64,62.87 40.27,63.23 IC1.18 40.27,66.31 41.91,67.94 41.91,73.66 | 40.64,62.87 40.64,62.23 39.37,60.96 36.2,60.96 | 36.2,60.96 35.08,60.96 L-IPWR.C
  Bottom 0.305: IC1.7 42.87,54.94 42.55,54.61 36.2,54.61 35.56,55.24 35.56,56.52 36.2,57.15 36.2,60.96 | 52.7,50.16 50.8,50.16 v50.8,56.52 | 45.09,66.04 v50.8,66.04
  Bottom 0.406: C-X32A.1 80.14,67.81 80.01,67.94 72.39,67.94 71.75,68.58 71.75,71.72 IC2.3
  Bottom 0.813: D-V12.A C-VCC.-